# Altium schematic sheet POWER-BUDGET.SchDoc
size A4; SheetNumber: 7; SheetTotal: 7
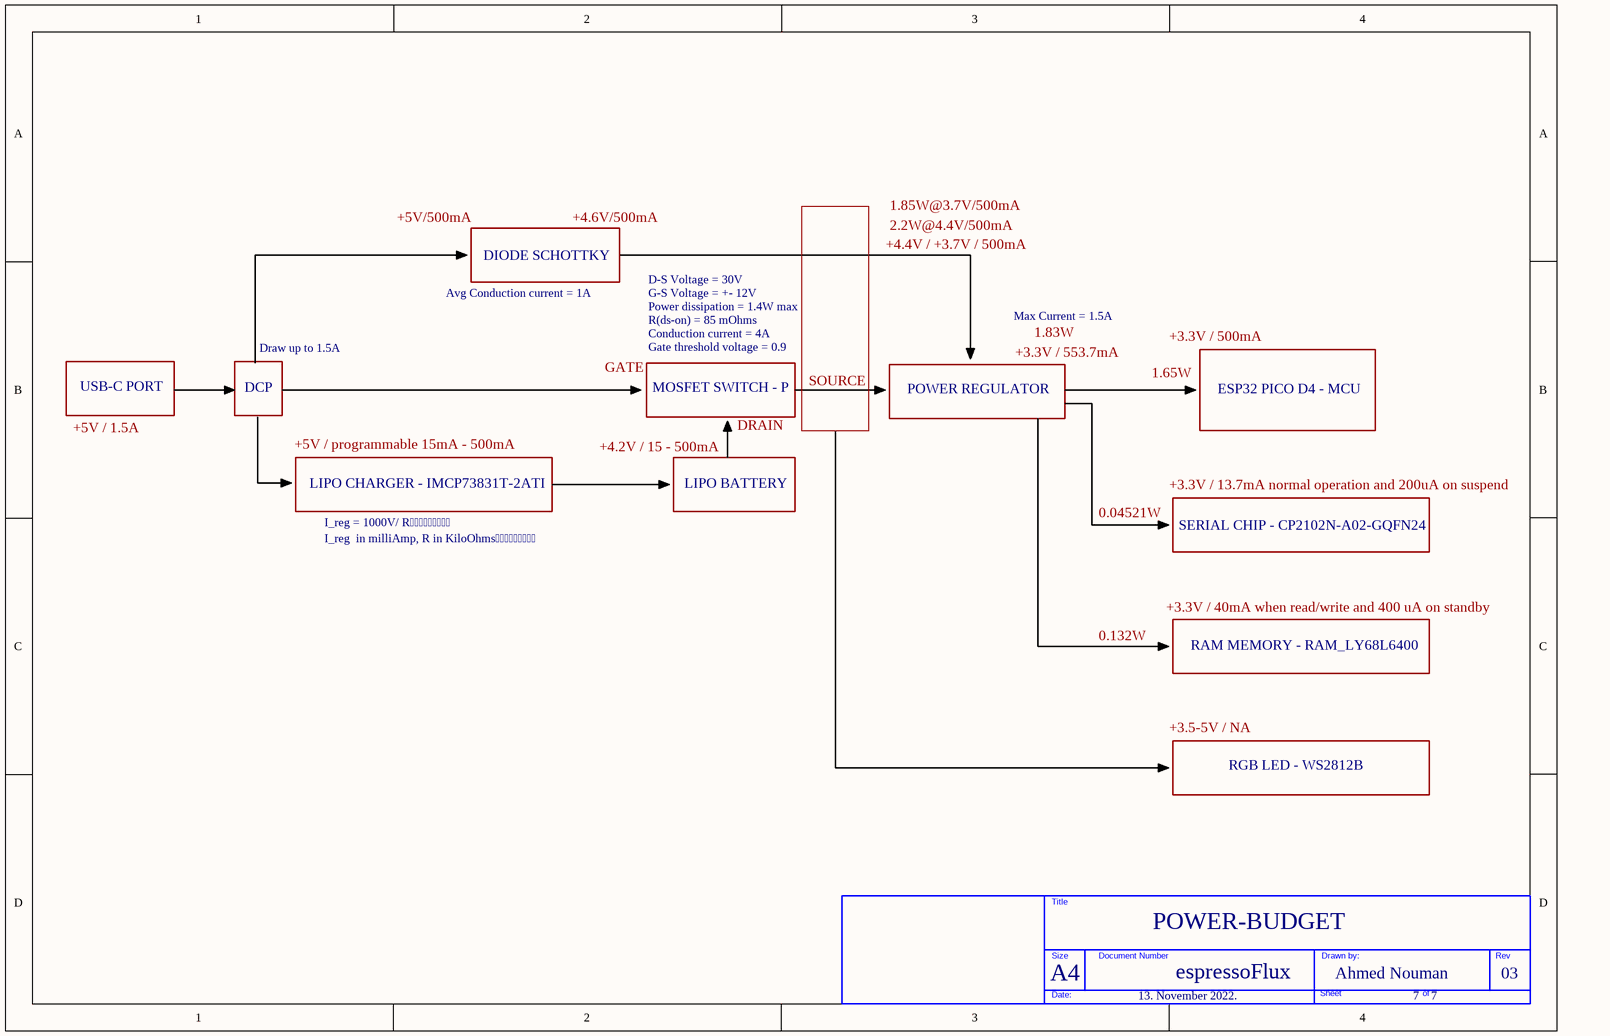
[diagram p0: POWER-BUDGET.SchDoc]

## Parts
?  (no value)  (graphical)

## Notes on the sheet
- +5V/500mA
- +4.6V/500mA
- +4.4V / +3.7V / 500mA
- 2.2W@4.4V/500mA
- 1.85W@3.7V/500mA
- Avg Conduction current = 1A
- DIODE SCHOTTKY
- Power dissipation = 1.4W max
- G-S Voltage = +- 12V
- D-S Voltage = 30V
- Draw up to 1.5A
- GATE
- Gate threshold voltage = 0.9
- Conduction current = 4A
- R(ds-on) = 85 mOhms
- SOURCE
- Max Current = 1.5A
- +3.3V / 553.7mA
- 1.83W
- 1.65W
- +3.3V / 500mA
- +5V / 1.5A
- USB-C PORT
- DCP
- +5V / programmable 15mA - 500mA
- +4.2V / 15 - 500mA
- MOSFET SWITCH - P
- DRAIN
- POWER REGULATOR
- ESP32 PICO D4 - MCU
- LIPO CHARGER - IMCP73831T-2ATI
- LIPO BATTERY
- 0.04521W
- +3.3V / 13.7mA normal operation and 200uA on suspend
- I_reg = 1000V/ R
- I_reg  in milliAmp, R in KiloOhms
- SERIAL CHIP - CP2102N-A02-GQFN24
- 0.132W
- +3.3V / 40mA when read/write and 400 uA on standby
- RAM MEMORY - RAM_LY68L6400
- +3.5-5V / NA
- RGB LED - WS2812B
- A4
- POWER-BUDGET
- espressoFlux
- Ahmed Nouman
- 03
- 13. November 2022.
- 7    7
- Title
- Size
- Document Number
- Drawn by:
- Rev
- Date:
- Sheet
- of

## Library data of the parts
? = TITLE BLOCK_BLANK